# Altium schematic sheet Top_Layer.SchDoc
size A4; SheetNumber: 2; SheetTotal: 2
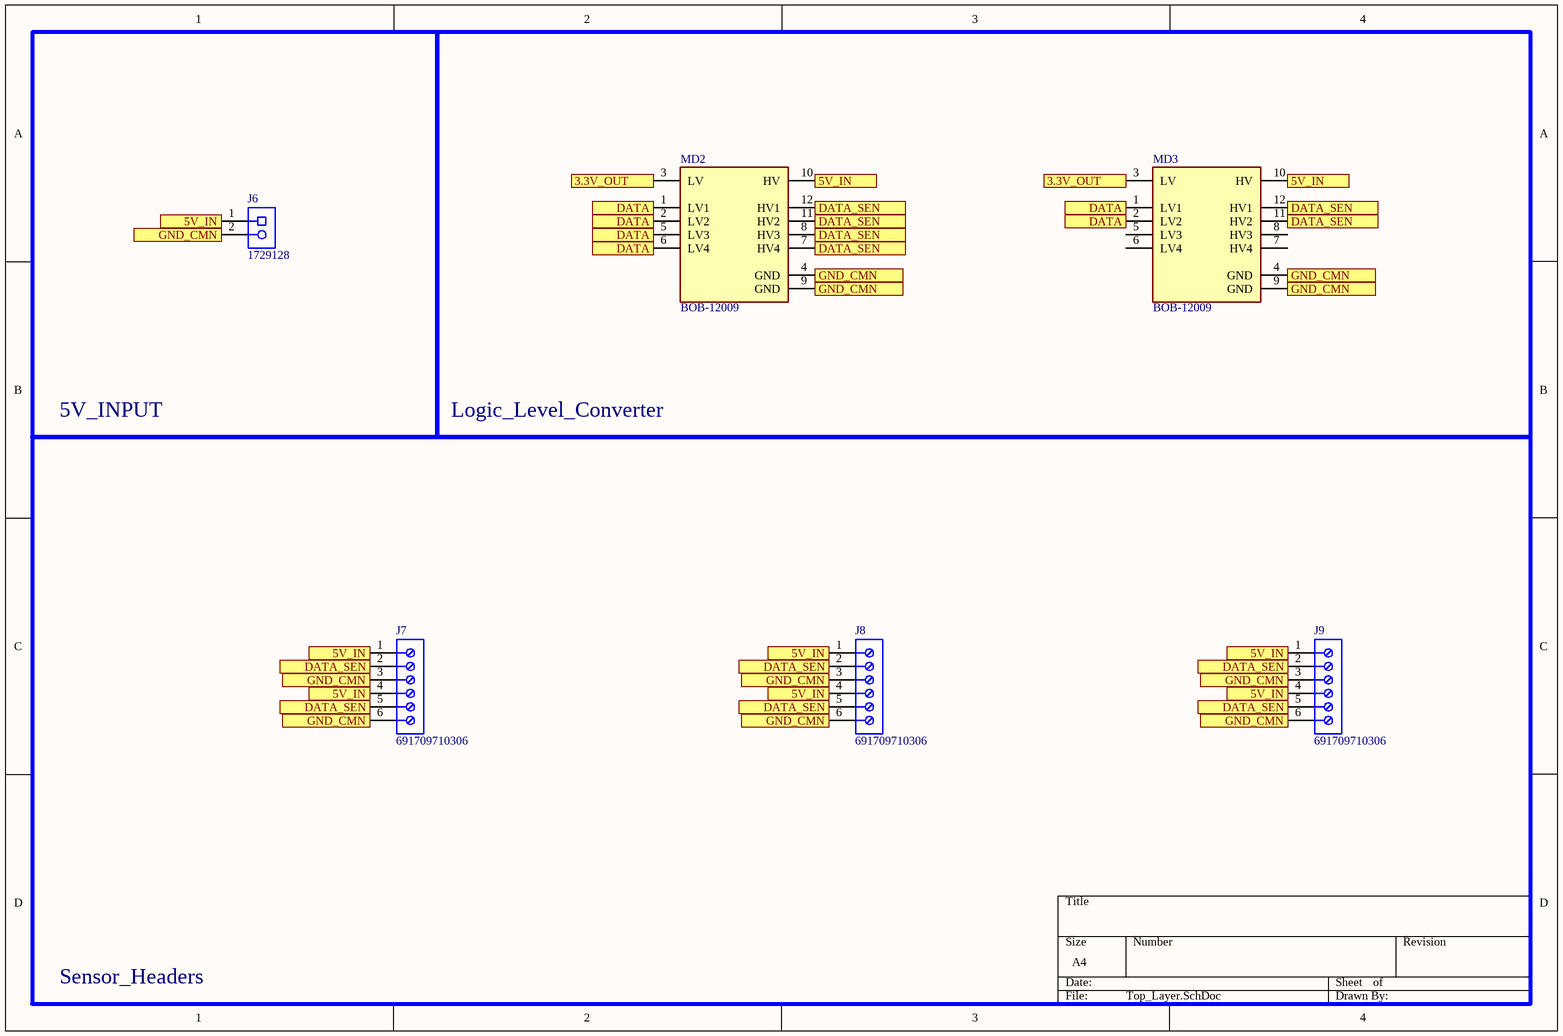
[diagram p0: Top_Layer.SchDoc]

## Parts
J6  1729128  [PHOE-1729128-2_V]
J7  691709710306  [691709710306]
J8  691709710306  [691709710306]
J9  691709710306  [691709710306]
MD2  BOB-12009  [FP-BOB-12009-MFG]
MD3  BOB-12009  [FP-BOB-12009-MFG]

## Blocks framed on the sheet
5V_INPUT: J6
Logic_Level_Converter: MD2 MD3
Sensor_Headers: J7-J9

## Ports
3.3V_OUT (see BottomLayer[2A], TopLayer[1A], TopLayer[4A], TopLayer[4C]), 3.3V_OUT (see BottomLayer[3A], TopLayer[1A], TopLayer[4A], TopLayer[4C]), 5V_IN (see BottomLayer[1A], BottomLayer[1C], BottomLayer[2C], BottomLayer[3A], BottomLayer[4A], BottomLayer[4C], TopLayer[1D], TopLayer[2B], TopLayer[3A], TopLayer[3C]), 5V_IN (see BottomLayer[1A], BottomLayer[1C], BottomLayer[2C], BottomLayer[3A], BottomLayer[4C], TopLayer[1D], TopLayer[2B], TopLayer[3A], TopLayer[3C]), 5V_IN (see BottomLayer[1A], BottomLayer[1C], BottomLayer[2C], BottomLayer[4A], BottomLayer[4C], TopLayer[1D], TopLayer[2B], TopLayer[3A], TopLayer[3C]), 5V_IN (see BottomLayer[1C], BottomLayer[2C], BottomLayer[3A], BottomLayer[4A], BottomLayer[4C], TopLayer[1D], TopLayer[2B], TopLayer[3A], TopLayer[3C]), DATA (see BottomLayer[2A], BottomLayer[3A], TopLayer[1B], TopLayer[4A], TopLayer[4B], TopLayer[4C]), DATA_SEN (see BottomLayer[1C], BottomLayer[2C], BottomLayer[3A], BottomLayer[4A], BottomLayer[4C]), GND_CMN (see BottomLayer[1A], BottomLayer[1C], BottomLayer[2C], BottomLayer[3B], BottomLayer[4B], BottomLayer[4C], TopLayer[1D], TopLayer[2B], TopLayer[4B], TopLayer[4C]), GND_CMN (see BottomLayer[1C], BottomLayer[2C], BottomLayer[3B], BottomLayer[4B], BottomLayer[4C], TopLayer[1D], TopLayer[2B], TopLayer[4B], TopLayer[4C])

## Nets
3.3V_OUT: MD2.3(LV) MD3.3(LV) ; port 3.3V_OUT
5V_IN: J6.1 J7.1 J7.4 J8.1 J8.4 J9.1 J9.4 MD2.10(HV) MD3.10(HV) ; port 5V_IN
DATA: MD2.1(LV1) MD2.2(LV2) MD2.5(LV3) MD2.6(LV4) MD3.1(LV1) MD3.2(LV2) ; port DATA
DATA_SEN: J7.2 J7.5 J8.2 J8.5 J9.2 J9.5 MD2.7(HV4) MD2.8(HV3) MD2.11(HV2) MD2.12(HV1) MD3.11(HV2) MD3.12(HV1) ; port DATA_SEN
GND_CMN: J6.2 J7.3 J7.6 J8.3 J8.6 J9.3 J9.6 MD2.4(GND) MD2.9(GND) MD3.4(GND) MD3.9(GND) ; port GND_CMN

Not connected (* = marked no-connect by the designer): MD3 5(LV3) 6(LV4) 7(HV4) 8(HV3)

## Library data of the parts
J6 = CMP-2000-05815-1: PCB Terminal Block, 13.5 A, 400 V, 2-Pin THD, RoHS, Bulk; Manufacturer: Phoenix Contact; Package Version: 03/2015; No. of Rows: 1; Pitch: 5.08mm; No. of Positions: 2; Voltage Rating: 400V; Current Rating: 13500mA; Manufacturer URL: http://www.phoenixcontact.com/; Datasheet URL: https://datasheet.ciiva.com/16046/1729128-16046181.pdf; RoHS: TRUE; Package URL: https://www.phoenixcontact.com/online/portal/pi/pxc/product_detail_page/!ut/p/b1/3VdJjqNKFDxLH8AFycySyWY2ozFsEPOMMQaDOX1XedGL_1Vdm5YXJleknhSKeBkvI6EA8ncAo3AYoDhBQGco6KN7VURTdemj9us_IEKEZo_YHiPAEWEFmDGOHMORkqKYCORBZxgL7ZoaZYcbFFUZ3fqxSY6GOuxydWUuHqz1ynmMFygu583Bob0Ewr6Sd_l-5m-kAueHiB0jpRwZwe58wwtkpxtMYd_LmGcDRU02dRNEyWt6Y2ti5pSyJ_reIkzIulrqApdnbT11V5jnCKbYNCvhEM1MCpPByat_X379-iThf08CI5GfOPqfBeS3BRoBOdD55AKVv0iLwCMq-2BrzXWSGRH7pUGD9uwXQjiph3xL0DKQwdGa0JImiIOmBNOestqgwTHSSs2oOep-78apyXQBvNi8ZLaFjvjWvcaUEBu0MC6Wbe-d6mB0FAebo2lUWinqYaZs5DAYzV0RP9yitUjnGJ0iI9xhZkT42OCQNUJJhkgWINNQLP2JFP6OpMg3JCVg70jqHT0lvKOnhHf0lPuOnnLf0VPuWx6_dxwUIvwk5WMkT0kLL1mh61l2yZVSzG3pYV_bqo-mj6uMKwKwdnnW8Jh5RTOJzMOA5c-eJDaZQw4mTMPH02PvS_ZAqNVjVTo2WyYLkwH_KU1mmmG5kjRhDqPXLwwVHvVOjCM60-fpXvTDfMGW1PVFVS1r4e4yVDk4ZdNbkUHvqPqQSeian4UD39fNKmachqdJ1NJbyk8rXT9mXTvPk3oE5meulKGgiruPJek-4I9hTT6G8ZLOyRSm2RRVbThERQad5OS28hdt4YW4vG0stgYYzsWsK4_7y6DZMjJSCqri1kyiZR5vD7pwIrNR7QwPHTcLTI5qT7eRlpHrdGiupYlqQDJ7zy_CND8fWWBoLRXxk1RVcXiBQwbTD4Xi7KL-FuO94t9xaqweXzH; PartNumber: 1729128; Package Description: 2-Pin Through Hole Device, Body 8.1 x 10.16 mm, Pitch 5.08 mm; Datasheet Version: 12/2013; Mounting Technology: ThroughHole; Orientation: Horizontal; Package Reference: 1729128-2; Packing: Bulk
J7-J9 = CMP-1502-03339-2: NexarPartId: 34171773; Wire/Cable Gauge: 30AWG; Pitch: 5mm; Wire Gauge (Min): 14AWG; Plating: Steel; Current: 6A; Number of Levels: 1; Voltage Rating: 300V; Number of Contacts: 6; Connector Type: Screw; Flammability Rating: UL94 V-0; Housing Material: Nylon; REACH SVHC: Unknown; Lead Pitch: 5mm; Contact Plating: Tin; Mount: Surface Mount; Height: 10.2mm; Number of Rows: 1; Min Operating Temperature: -40°C; RoHS: Compliant; Color: Black; Contact Material: Nickel; Wire Gauge (Max): 30AWG; Number of Pins: 6; Length: 30mm; Number of Positions: 6; Packaging: Tape & Reel (TR); Number of Positions Per Level: 6; Max Operating Temperature: 130°C; Termination: Screw; Current Rating: 6A; Voltage: 300V
MD2 MD3 = CMP-157458-000001-1: LOGIC LEVEL CONVERTER - BI-DIREC; Logic Function: Translator